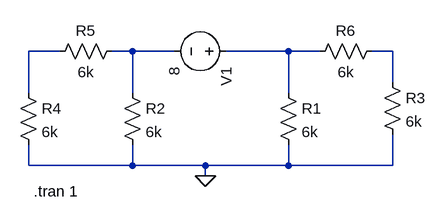
[diagram p0: schematic Q1.asc]
Q1.asc, the LTspice schematic file:
Version 4
SHEET 1 880 680
WIRE -432 -128 -480 -128
WIRE -320 -128 -352 -128
WIRE -256 -128 -320 -128
WIRE -80 -128 -176 -128
WIRE -32 -128 -80 -128
WIRE 80 -128 48 -128
WIRE 80 -80 80 -128
WIRE -480 -64 -480 -128
WIRE -320 -64 -320 -128
WIRE -80 -64 -80 -128
WIRE -480 48 -480 16
WIRE -320 48 -320 16
WIRE -320 48 -480 48
WIRE -208 48 -320 48
WIRE -80 48 -80 16
WIRE -80 48 -208 48
WIRE 80 48 80 0
WIRE 80 48 -80 48
WIRE -208 64 -208 48
FLAG -208 64 0
SYMBOL voltage -160 -128 R90
WINDOW 123 0 0 Left 0
WINDOW 39 0 0 Left 0
SYMATTR InstName V1
SYMATTR Value 8
SYMBOL res -96 -80 R0
SYMATTR InstName R1
SYMATTR Value 6k
SYMBOL res -336 -80 R0
SYMATTR InstName R2
SYMATTR Value 6k
SYMBOL res 64 -96 R0
SYMATTR InstName R3
SYMATTR Value 6k
SYMBOL res -496 -80 R0
SYMATTR InstName R4
SYMATTR Value 6k
SYMBOL res -336 -144 R90
WINDOW 0 0 56 VBottom 2
WINDOW 3 32 56 VTop 2
SYMATTR InstName R5
SYMATTR Value 6k
SYMBOL res 64 -144 R90
WINDOW 0 0 56 VBottom 2
WINDOW 3 32 56 VTop 2
SYMATTR InstName R6
SYMATTR Value 6k
TEXT -472 88 Left 2 !.tran 1

The netlist it stands for:
* Q1.asc
V1 N003 N002 8
R1 N003 0 6k
R2 N002 0 6k
R3 N004 0 6k
R4 N001 0 6k
R5 N002 N001 6k
R6 N004 N003 6k
.tran 1
.backanno
.end